# Altium schematic sheet #NIP涡轮驱动板-MCU.SchDoc
size A3
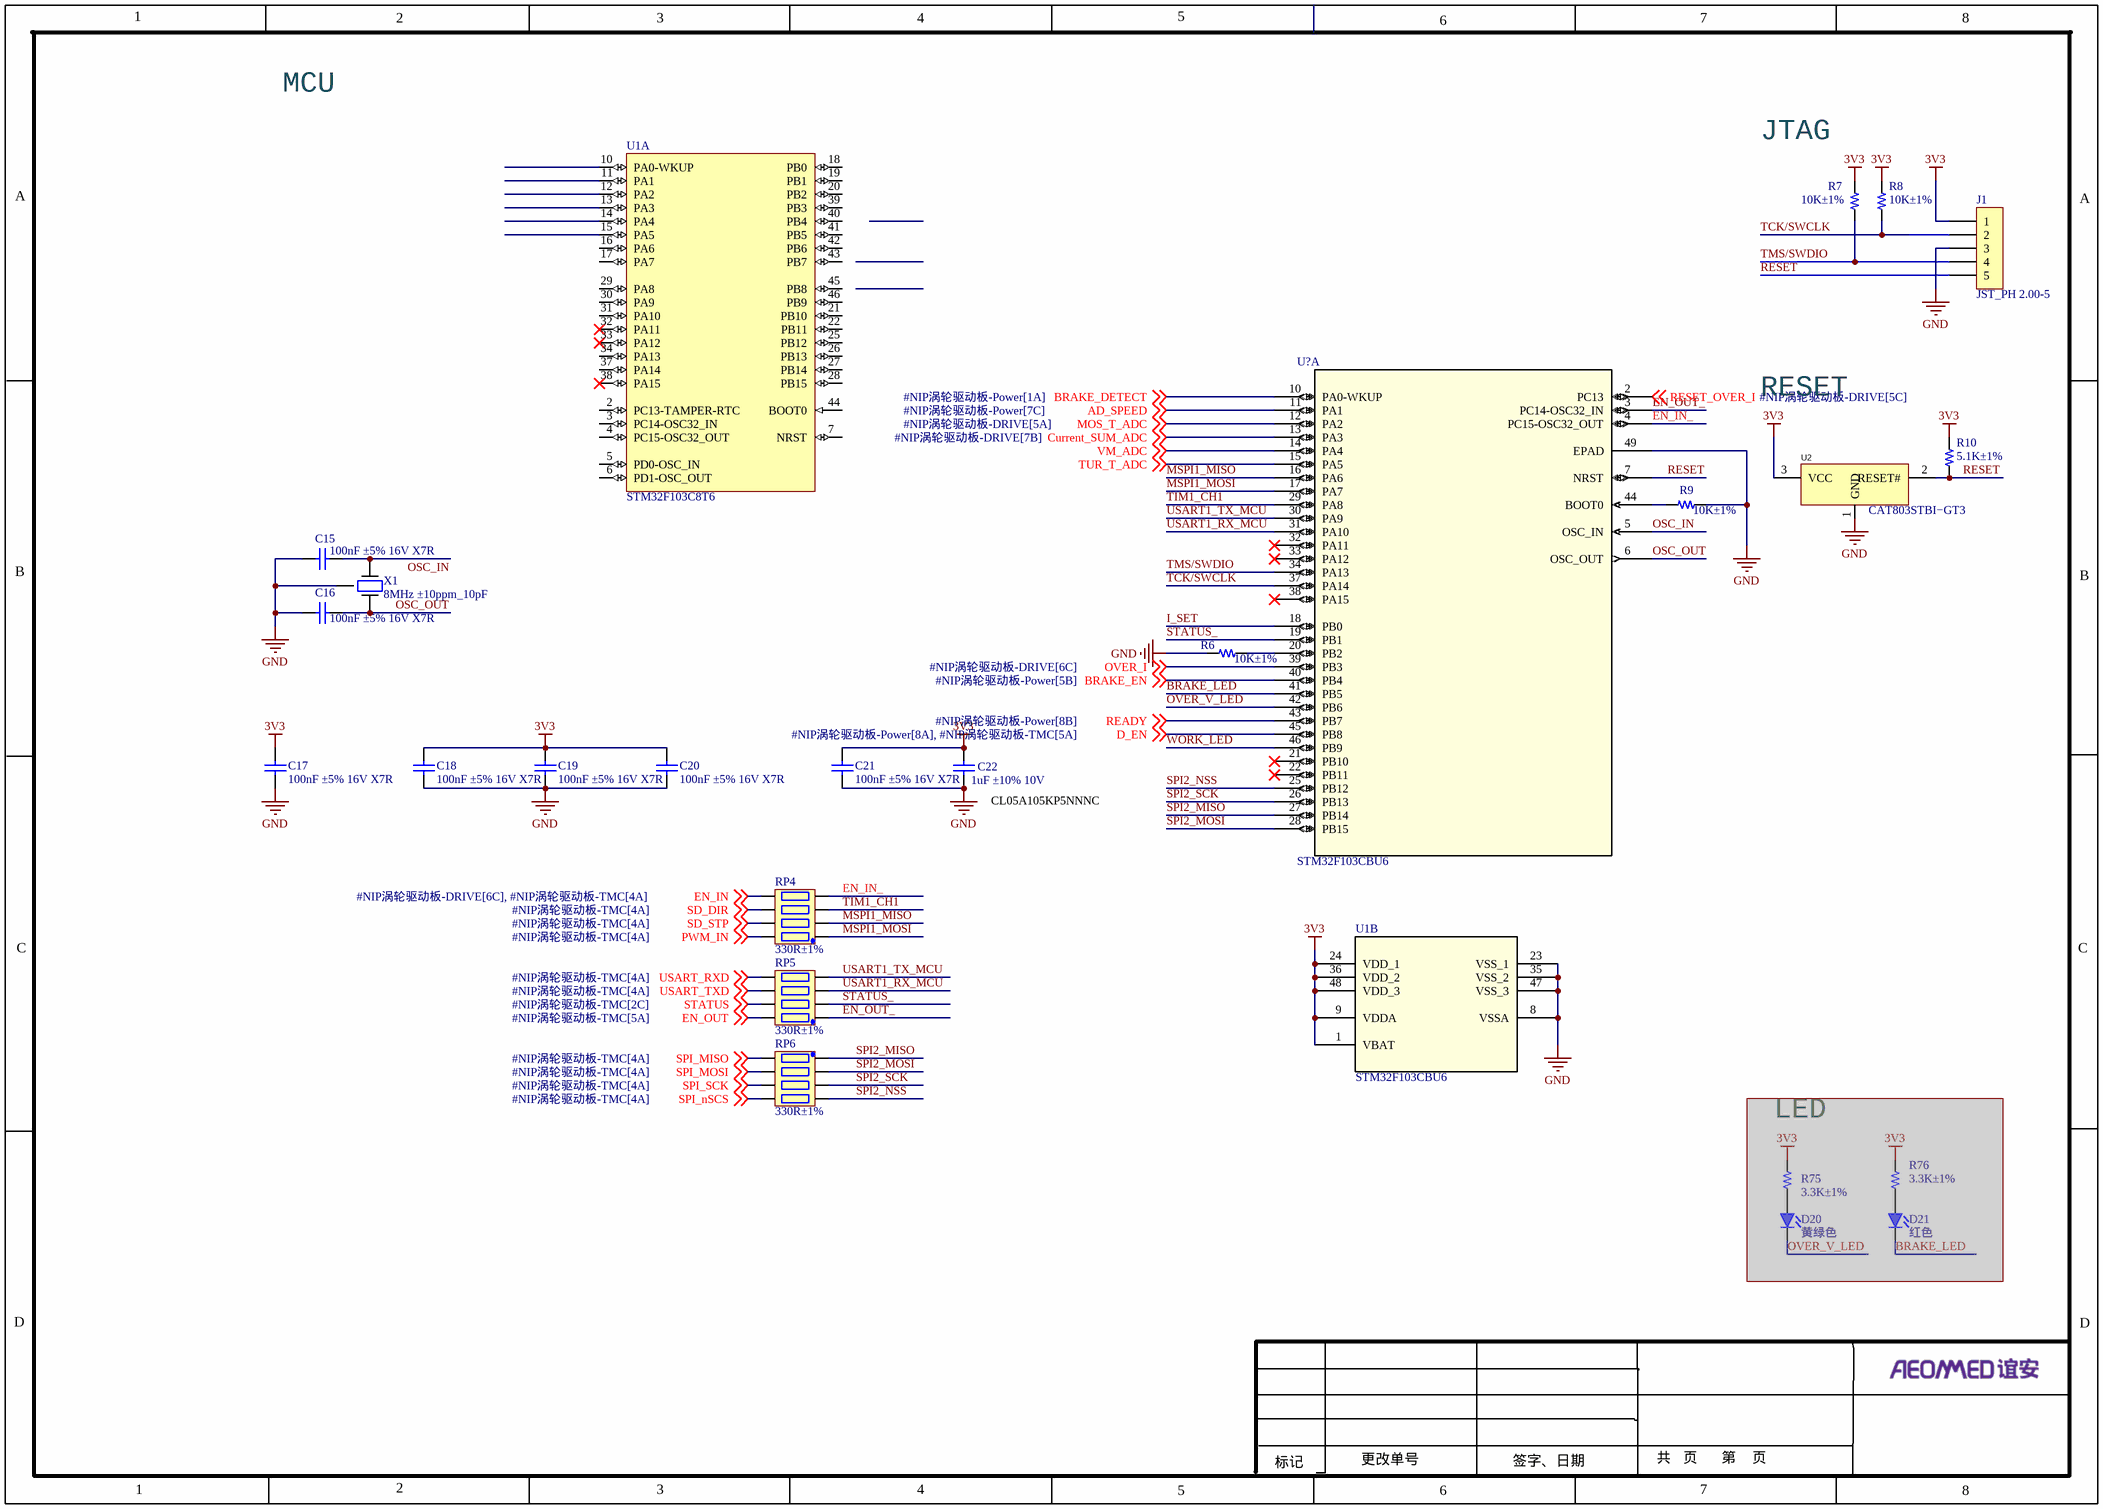
[diagram p0: #NIP涡轮驱动板-MCU.SchDoc]

## Parts
(Parts that share a designator on the sheet are numbered #1, #2 ... from top to bottom, then left to right.)
C15  100nF ±5% 16V X7R  [C0402]
C16  100nF ±5% 16V X7R  [C0402]
C17  100nF ±5% 16V X7R  [C0402]
C18  100nF ±5% 16V X7R  [C0402]
C19  100nF ±5% 16V X7R  [C0402]
C20  100nF ±5% 16V X7R  [C0402]
C21  100nF ±5% 16V X7R  [C0402]
C22  1uF ±10% 10V  [C0402]
D20  黄绿色  [LED-0805]  (masked out: inside a compile mask, not in the netlist)
D21  红色  [LED-0805]  (masked out: inside a compile mask, not in the netlist)
J1  JST_PH 2.00-5  [JST_PH 2.00-5]
R6  10K±1%  [R0402]
R7  10K±1%  [R0402]
R8  10K±1%  [R0402]
R9  10K±1%  [R0402]
R10  5.1K±1%  [R0402]
R75  3.3K±1%  [R-0603]  (masked out: inside a compile mask, not in the netlist)
R76  3.3K±1%  [R-0603]  (masked out: inside a compile mask, not in the netlist)
RP4  330R±1%  [RES-ARRAY-SMD_0402-8P-L2.0-W1.0-BL]
RP5  330R±1%  [RES-ARRAY-SMD_0402-8P-L2.0-W1.0-BL]
RP6  330R±1%  [RES-ARRAY-SMD_0402-8P-L2.0-W1.0-BL]
U1#1  STM32F103C8T6  [STM-LQFP48_N]  (part A of 2)
U1#2  STM32F103CBU6  [UFQFPN-48_7X7X0P55MM]  (part B of 2)
U2  CAT803STBI−GT3  [SOT-23-3_L2.9-W1.3-P1.90-LS2.4-BR]
U?  STM32F103CBU6  [UFQFPN-48_7X7X0P55MM]  (part A of 2)
X1  8MHz ±10ppm_10pF  [CRYSTAL_3225]

## Nets
3V3: C17.1 C18.1 C19.2 C20.2 C21.1 C22.2 J1.1 R7.2 R8.2 R10.2 U1#2.1(VBAT) U1#2.9(VDDA) U1#2.24(VDD_1) U1#2.36(VDD_2) U1#2.48(VDD_3) U2.3(VCC)
GND: C15.2 C16.2 C17.2 C18.2 C19.1 C20.1 C21.2 C22.1 J1.3 R6.2 R9.2 U1#2.8(VSSA) U1#2.23(VSS_1) U1#2.35(VSS_2) U1#2.47(VSS_3) U2.1(GND) U?.49(EPAD) X1.G
AD_SPEED: U?.11(PA1) ; off-sheet AD_SPEED
BRAKE_DETECT: U?.10(PA0-WKUP) ; off-sheet BRAKE_DETECT
BRAKE_EN: U?.40(PB4) ; off-sheet BRAKE_EN
BRAKE_LED: U?.41(PB5)
Current_SUM_ADC: U?.13(PA3) ; off-sheet Current_SUM_ADC
D_EN: U?.45(PB8) ; off-sheet D_EN
EN_IN: RP4.5 ; off-sheet EN_IN
EN_IN_: RP4.4 U?.4(PC15-OSC32_OUT)
EN_OUT: RP5.8 ; off-sheet EN_OUT
EN_OUT_: RP5.1 U?.3(PC14-OSC32_IN)
I_SET: U?.18(PB0)
MOS_T_ADC: U?.12(PA2) ; off-sheet MOS_T_ADC
MSPI1_MISO: RP4.2 U?.16(PA6)
MSPI1_MOSI: RP4.1 U?.17(PA7)
OSC_IN: C15.1 U?.5(OSC_IN) X1.1
OSC_OUT: C16.1 U?.6(OSC_OUT) X1.3
OVER_I: U?.39(PB3) ; off-sheet OVER_I
OVER_V_LED: U?.42(PB6)
PWM_IN: RP4.8 ; off-sheet PWM_IN
READY: U?.43(PB7) ; off-sheet READY
RESET: J1.5 R10.1 U2.2(RESET#) U?.7(NRST)
RESET_OVER_I: U?.2(PC13) ; off-sheet RESET_OVER_I
SD_DIR: RP4.6 ; off-sheet SD_DIR
SD_STP: RP4.7 ; off-sheet SD_STP
SPI2_MISO: RP6.1 U?.27(PB14)
SPI2_MOSI: RP6.2 U?.28(PB15)
SPI2_NSS: RP6.4 U?.25(PB12)
SPI2_SCK: RP6.3 U?.26(PB13)
SPI_MISO: RP6.8 ; off-sheet SPI_MISO
SPI_MOSI: RP6.7 ; off-sheet SPI_MOSI
SPI_nSCS: RP6.5 ; off-sheet SPI_nSCS
SPI_SCK: RP6.6 ; off-sheet SPI_SCK
STATUS: RP5.7 ; off-sheet STATUS
STATUS_: RP5.2 U?.19(PB1)
TCK/SWCLK: J1.2 R8.1 U?.37(PA14)
TIM1_CH1: RP4.3 U?.29(PA8)
TMS/SWDIO: J1.4 R7.1 U?.34(PA13)
TUR_T_ADC: U?.15(PA5) ; off-sheet TUR_T_ADC
USART1_RX_MCU: RP5.3 U?.31(PA10)
USART1_TX_MCU: RP5.4 U?.30(PA9)
USART_RXD: RP5.5 ; off-sheet USART_RXD
USART_TXD: RP5.6 ; off-sheet USART_TXD
VM_ADC: U?.14(PA4) ; off-sheet VM_ADC
WORK_LED: U?.46(PB9)
NetR6_1: R6.1 U?.20(PB2)
NetR9_1: R9.1 U?.44(BOOT0)

Not connected (* = marked no-connect by the designer): U1#1 2(PC13-TAMPER-RTC) 3(PC14-OSC32_IN) 4(PC15-OSC32_OUT) 5(PD0-OSC_IN) 6(PD1-OSC_OUT) 7(NRST) 10(PA0-WKUP) 11(PA1) 12(PA2) 13(PA3) 14(PA4) 15(PA5) 16(PA6) 17(PA7) 18(PB0) 19(PB1) 20(PB2) 21(PB10) 22(PB11) 25(PB12) 26(PB13) 27(PB14) 28(PB15) 29(PA8) 30(PA9) 31(PA10) 32(PA11)* 33(PA12)* 34(PA13) 37(PA14) 38(PA15)* 39(PB3) 40(PB4) 41(PB5) 42(PB6) 43(PB7) 44(BOOT0) 45(PB8) 46(PB9); U? 21(PB10)* 22(PB11)* 32(PA11)* 33(PA12)* 38(PA15)*

## Notes on the sheet
- MCU
- JTAG
- RESET
- (near C22) CL05A105KP5NNNC
- (near R75) LED
- 1
- 2
- 3
- 4
- 5
- 6
- 7
- 8
- A
- B
- C
- D
- 更改单号
- 共   页      第    页
- 标记
- 签字、日期

## Library data of the parts
C15-C22 = Cap: Capacitor; Published: 8-Jun-2000; LatestRevisionDate: 17-Jul-2002; LatestRevisionNote: Re-released for DXP Platform.; PackageReference: RAD-0.3; Publisher: Altium Limited; PackageDescription: Radial Cap, Thru-Hole; 2 Leads; 0.3 in Pin Spacing
D20 = LED-0805: 品牌:Everlight（亿光），型号17-21SYGC/S530-E2/TR8，Typ.23mcd@20mA，ROHS
D21 = LED-0805: 品牌:Everlight（亿光），型号:17-21SURC/S530-A3/TR8，Typ.61mcd@20mA, ROHS
J1 = JST_PH 2.00-5: 品牌：JST 型号：B5B-PH-K-S，直插，间距2.00，5pin; 名称: 插座2针，2.0间距; 制造商: JST; 物料编号: B5B-PH-K-S
R6-R10 R75 R76 = R-0603
RP4-RP6 = RP-0603
U1#1 = STM32F103C8T6: ARM Cortex-M3 32-bit MCU, 64 KB Flash, 20 KB Internal RAM, 37 I/Os, 48-pin LQFP, -40 to 85 degC, Tray; A/D Converter: 2x12-bit (10 Channel); FLASH Size (Prog) (kB): 64; I/Os (High Current): 37; Internal RAM Size (kB): 20; Operating Frequency(F) (Processor speed) (MHz): 72; Supply Voltage(Vcc) min (V): 2; DatasheetVersion: Rev. 16; PackageVersion: Rev. 6, 06/2013; PackageReference: LQFP48; PackageDescription: 48-Pin Low Profile Quad Flat Package, 7 x 7 mm Body, 0.5 mm Pitch; Supplier 1: Digi-Key; Supplier Part Number 1: 497-6063-ND; Supplier 2: Farnell; Supplier Part Number 2: 1447637; Supplier 3: Newark; Supplier Part Number 3: 59M2182; Supplier 4: Newark; Supplier Part Number 4: 57P1222; Supplier 5: Mouser; Supplier Part Number 5: 511-STM32F103C8T6; Core: ARM Cortex-M3; Packing: Tray; Mounting Technology: Surface Mount; PartNumber: STM32F103C8T6; ComponentLink1Description: Manufacturer URL; ComponentLink1URL: http://www.st.com/web/en/home.html; ComponentLink2Description: Datasheet; ComponentLink2URL: http://www.st.com/st-web-ui/static/active/en/resource/technical/document/datasheet/CD00161566.pdf; ComponentLink3Description: Package Specification; ComponentLink3URL: http://www.st.com/st-web-ui/static/active/en/resource/technical/document/datasheet/DM00058181.pdf
U1#2 U? = STM32F103CBU6: No Description Available; Mfr_Name: STMicroelectronics; RefDes: RefDes; Type: Type
U2 = CAT8xxxxxI-(G)T3: 3-Pin Microprocessor Power Supply Supervisors / − CAT803: Open−Drain Active LOW Reset / − CAT809: Push−Pull Active LOW Reset / − CAT810: Push−Pull Active HIGH Reset; Manufacturer: TI(德州仪器); Name: TLV70015DDCR; Add into BOM: yes; Output Type: 固定; Output Polarity: 正; Number of Outputs: 1; Maximum Input Voltage: 5.5V; Output Voltage: 1.5V; Dropout Voltage: 250mV@(200mA); Quiescent Current (Ground Current): 55uA; Output Current: 200mA; Power Supply Rejection Ratio (PSRR): 68dB@(1kHz); Symbol: TLV70015DDCR; Device: TLV70015DDCR; LCSC Part Name: TLV70015DDCR; Supplier Part: C2865100; Manufacturer Part: TLV70015DDCR; Supplier Footprint: SOT-23-Thin-5; JLCPCB Part Class: Extended Part; Datasheet: https://atta.szlcsc.com/upload/public/pdf/source/20230221/CBA3FAF2ECD8317094AE1D26AA0CA23B.pdf; Supplier: LCSC; Convert to PCB: yes; Operating Temperature: -40℃~+125℃@(Tj)
X1 = CRYSTAL: Crystal 8MHz ±10ppm 10pF 200 Ohm -10°C ~ 60°C Surface Mount 4-SMD, No Lead (DFN, LCC); Manufacturer: Abracon LLC; Manufacturer Part Number: ABM3B-8.000MHZ-10-1-U-T; Operating Mode: Fundamental; Supplier 1: Digi-Key; Supplier Part Number 1: 535-9721-1-ND; RoHS: RoHS Compliant; Category: Crystals, Oscillators, Resonators; Stock: 35437; Pricing 1: 1=0.69, 10=0.578, 50=0.5198, 100=0.462, 500=0.4389 (USD); Packaging: Cut Tape (CT); Part Status: Active; Type: MHz Crystal; Frequency Stability: ±10ppm; Frequency Tolerance: ±10ppm; Load Capacitance: 10pF; Operating Temperature: -10°C ~ 60°C; Ratings: -; Mounting Type: Surface Mount; Package / Case: 4-SMD, No Lead; Size / Dimension: 0.197" L x 0.126" W (5.00mm x 3.20mm); Height - Seated (Max): 0.043" (1.10mm); ComponentLink1URL: http://www.abracon.com/Resonators/abm3b.pdf; ComponentLink1Description: http://www.abracon.com/Resonators/abm3b.pdf; Supplier 2: Digi-Key; Supplier Part Number 2: 535-9721-2-ND; Pricing 2: 1000=0.336, 3000=0.315, 5000=0.3045, 10000=0.294 (USD)